# Altium schematic sheet Power.SchDoc
size A4
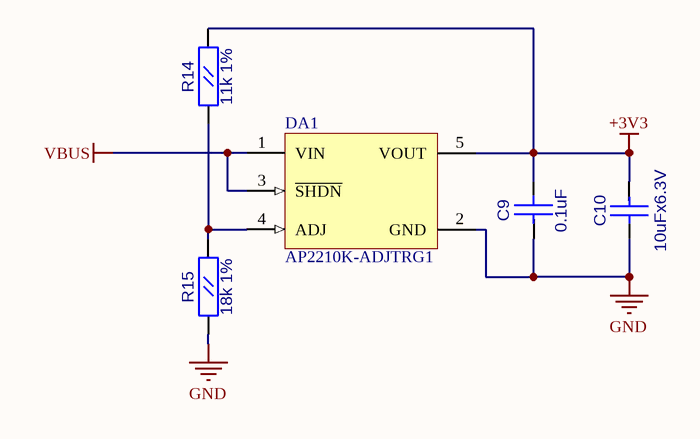
[diagram p0: Power.SchDoc]

## Parts
C9  0.1uF  [CC0603]
C10  10uFx6.3V  [CC0805]
DA1  AP2210K-ADJTRG1  [SOT23-5]
R14  11k 1%  [RC0603]
R15  18k 1%  [RC0603]

## Nets
+3V3: C9.1(A) C10.2(B) DA1.5(VOUT) R14.2(B)
GND: C9.2(B) C10.1(A) DA1.2(GND) R15.1(A)
VBUS: DA1.1(VIN) DA1.3(~{SHDN})
NetDA1_4: DA1.4(ADJ) R14.1(A) R15.2(B)

## Library data of the parts
C9 = CC0603: Value: 0.1uF
C10 = CC0805: Value: 10uFx6.3V
DA1 = MCP1824T-ADJE/OT: 300 mA, Low Voltage, Low Quiescent Current LDO Regulator, 5-Pin SOT-223, Extended Temperature, Tape and Reel; Published: 29-Jan-2009; DatasheetVersion: revA, Aug-2007; PackageVersion: revAW, Oct-2008; PackageReference: SOT-223-DC5; Publisher: Altium Limited; PackageDescription: 5-Lead Plastic Small Outline Transistor (DC) [SOT-223]; ComponentLink1Description: Manufacturer Link; ComponentLink1URL: http://www.microchip.com; ComponentLink2Description: Datasheet; ComponentLink2URL: http://ww1.microchip.com/downloads/en/DeviceDoc/22070a.pdf; ComponentLink3Description: Packaging Specification; ComponentLink3URL: http://ww1.microchip.com/downloads/en/PackagingSpec/00049AW.pdf
R14 R15 = RC0603
  R14: Value: 11k 1%
  R15: Value: 18k 1%